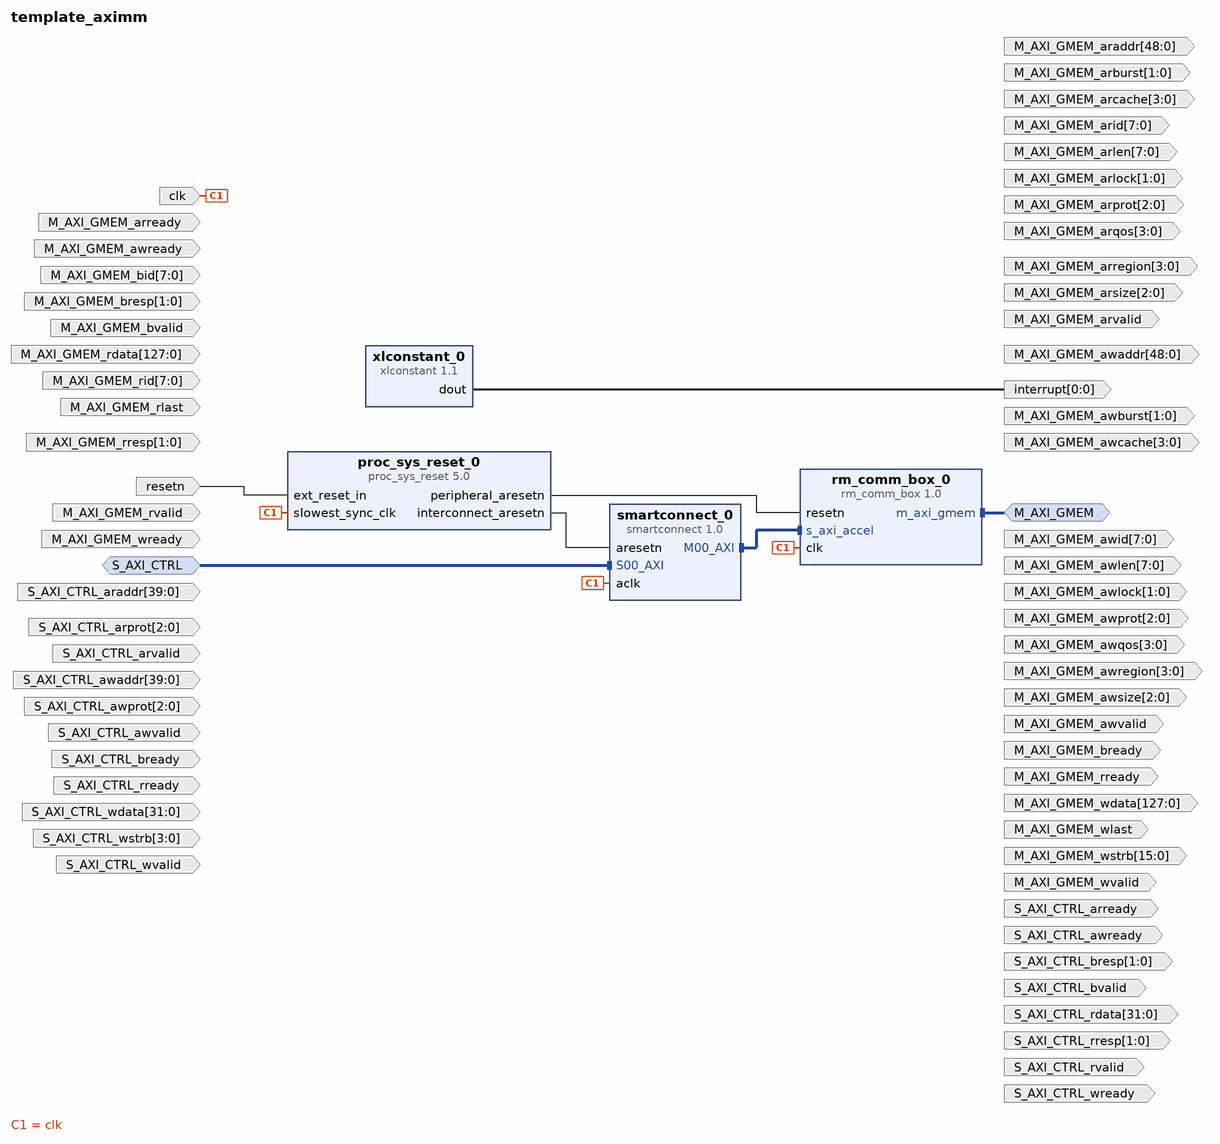
[diagram p0: block diagram of the top level]
# Vivado block design template_aximm, xck26-sfvc784-2LV-c, Vivado 2022.1
create_bd_design template_aximm

create_bd_intf_port -mode Master -vlnv xilinx.com:interface:aximm_rtl:1.0 M_AXI_GMEM
set_property -dict [list \
  CONFIG.ADDR_WIDTH 49 \
  CONFIG.ARUSER_WIDTH 0 \
  CONFIG.AWUSER_WIDTH 0 \
  CONFIG.BUSER_WIDTH 0 \
  CONFIG.CLK_DOMAIN opendfx_shell_zynq_ultra_ps_e_0_0_pl_clk3 \
  CONFIG.DATA_WIDTH 128 \
  CONFIG.FREQ_HZ 249997498 \
  CONFIG.HAS_BRESP 1 \
  CONFIG.HAS_BURST 1 \
  CONFIG.HAS_CACHE 1 \
  CONFIG.HAS_LOCK 1 \
  CONFIG.HAS_PROT 1 \
  CONFIG.HAS_QOS 1 \
  CONFIG.HAS_REGION 1 \
  CONFIG.HAS_RRESP 1 \
  CONFIG.HAS_WSTRB 1 \
  CONFIG.ID_WIDTH 8 \
  CONFIG.INSERT_VIP 0 \
  CONFIG.MAX_BURST_LENGTH 256 \
  CONFIG.NUM_READ_OUTSTANDING 2 \
  CONFIG.NUM_READ_THREADS 1 \
  CONFIG.NUM_WRITE_OUTSTANDING 2 \
  CONFIG.NUM_WRITE_THREADS 1 \
  CONFIG.PHASE 0.0 \
  CONFIG.PROTOCOL AXI4 \
  CONFIG.READ_WRITE_MODE READ_WRITE \
  CONFIG.RUSER_BITS_PER_BYTE 0 \
  CONFIG.RUSER_WIDTH 0 \
  CONFIG.SUPPORTS_NARROW_BURST 1 \
  CONFIG.WUSER_BITS_PER_BYTE 0 \
  CONFIG.WUSER_WIDTH 0 \
] [get_bd_intf_ports M_AXI_GMEM]
create_bd_intf_port -mode Slave -vlnv xilinx.com:interface:aximm_rtl:1.0 S_AXI_CTRL
set_property -dict [list \
  CONFIG.ADDR_WIDTH 40 \
  CONFIG.ARUSER_WIDTH 0 \
  CONFIG.AWUSER_WIDTH 0 \
  CONFIG.BUSER_WIDTH 0 \
  CONFIG.CLK_DOMAIN opendfx_shell_zynq_ultra_ps_e_0_0_pl_clk3 \
  CONFIG.DATA_WIDTH 32 \
  CONFIG.FREQ_HZ 249997498 \
  CONFIG.HAS_BRESP 1 \
  CONFIG.HAS_BURST 0 \
  CONFIG.HAS_CACHE 0 \
  CONFIG.HAS_LOCK 0 \
  CONFIG.HAS_PROT 1 \
  CONFIG.HAS_QOS 0 \
  CONFIG.HAS_REGION 0 \
  CONFIG.HAS_RRESP 1 \
  CONFIG.HAS_WSTRB 1 \
  CONFIG.ID_WIDTH 0 \
  CONFIG.INSERT_VIP 0 \
  CONFIG.MAX_BURST_LENGTH 1 \
  CONFIG.NUM_READ_OUTSTANDING 8 \
  CONFIG.NUM_READ_THREADS 1 \
  CONFIG.NUM_WRITE_OUTSTANDING 8 \
  CONFIG.NUM_WRITE_THREADS 1 \
  CONFIG.PHASE 0.0 \
  CONFIG.PROTOCOL AXI4LITE \
  CONFIG.READ_WRITE_MODE READ_WRITE \
  CONFIG.RUSER_BITS_PER_BYTE 0 \
  CONFIG.RUSER_WIDTH 0 \
  CONFIG.SUPPORTS_NARROW_BURST 0 \
  CONFIG.WUSER_BITS_PER_BYTE 0 \
  CONFIG.WUSER_WIDTH 0 \
  CONFIG.master_id 1 \
] [get_bd_intf_ports S_AXI_CTRL]
create_bd_port -dir O -from 7 -to 0 M_AXI_GMEM_awid
create_bd_port -dir O -from 48 -to 0 M_AXI_GMEM_awaddr
create_bd_port -dir O -from 7 -to 0 M_AXI_GMEM_awlen
create_bd_port -dir O -from 2 -to 0 M_AXI_GMEM_awsize
create_bd_port -dir O -from 1 -to 0 M_AXI_GMEM_awburst
create_bd_port -dir O -from 1 -to 0 M_AXI_GMEM_awlock
create_bd_port -dir O -from 3 -to 0 M_AXI_GMEM_awcache
create_bd_port -dir O -from 2 -to 0 M_AXI_GMEM_awprot
create_bd_port -dir O -from 3 -to 0 M_AXI_GMEM_awregion
create_bd_port -dir O -from 3 -to 0 M_AXI_GMEM_awqos
create_bd_port -dir O M_AXI_GMEM_awvalid
create_bd_port -dir I M_AXI_GMEM_awready
create_bd_port -dir O -from 127 -to 0 M_AXI_GMEM_wdata
create_bd_port -dir O -from 15 -to 0 M_AXI_GMEM_wstrb
create_bd_port -dir O M_AXI_GMEM_wlast
create_bd_port -dir O M_AXI_GMEM_wvalid
create_bd_port -dir I M_AXI_GMEM_wready
create_bd_port -dir I -from 7 -to 0 M_AXI_GMEM_bid
create_bd_port -dir I -from 1 -to 0 M_AXI_GMEM_bresp
create_bd_port -dir I M_AXI_GMEM_bvalid
create_bd_port -dir O M_AXI_GMEM_bready
create_bd_port -dir O -from 7 -to 0 M_AXI_GMEM_arid
create_bd_port -dir O -from 48 -to 0 M_AXI_GMEM_araddr
create_bd_port -dir O -from 7 -to 0 M_AXI_GMEM_arlen
create_bd_port -dir O -from 2 -to 0 M_AXI_GMEM_arsize
create_bd_port -dir O -from 1 -to 0 M_AXI_GMEM_arburst
create_bd_port -dir O -from 1 -to 0 M_AXI_GMEM_arlock
create_bd_port -dir O -from 3 -to 0 M_AXI_GMEM_arcache
create_bd_port -dir O -from 2 -to 0 M_AXI_GMEM_arprot
create_bd_port -dir O -from 3 -to 0 M_AXI_GMEM_arregion
create_bd_port -dir O -from 3 -to 0 M_AXI_GMEM_arqos
create_bd_port -dir O M_AXI_GMEM_arvalid
create_bd_port -dir I M_AXI_GMEM_arready
create_bd_port -dir I -from 7 -to 0 M_AXI_GMEM_rid
create_bd_port -dir I -from 127 -to 0 M_AXI_GMEM_rdata
create_bd_port -dir I -from 1 -to 0 M_AXI_GMEM_rresp
create_bd_port -dir I M_AXI_GMEM_rlast
create_bd_port -dir I M_AXI_GMEM_rvalid
create_bd_port -dir O M_AXI_GMEM_rready
create_bd_port -dir I -from 39 -to 0 S_AXI_CTRL_awaddr
create_bd_port -dir I -from 2 -to 0 S_AXI_CTRL_awprot
create_bd_port -dir I S_AXI_CTRL_awvalid
create_bd_port -dir O S_AXI_CTRL_awready
create_bd_port -dir I -from 31 -to 0 S_AXI_CTRL_wdata
create_bd_port -dir I -from 3 -to 0 S_AXI_CTRL_wstrb
create_bd_port -dir I S_AXI_CTRL_wvalid
create_bd_port -dir O S_AXI_CTRL_wready
create_bd_port -dir O -from 1 -to 0 S_AXI_CTRL_bresp
create_bd_port -dir O S_AXI_CTRL_bvalid
create_bd_port -dir I S_AXI_CTRL_bready
create_bd_port -dir I -from 39 -to 0 S_AXI_CTRL_araddr
create_bd_port -dir I -from 2 -to 0 S_AXI_CTRL_arprot
create_bd_port -dir I S_AXI_CTRL_arvalid
create_bd_port -dir O S_AXI_CTRL_arready
create_bd_port -dir O -from 31 -to 0 S_AXI_CTRL_rdata
create_bd_port -dir O -from 1 -to 0 S_AXI_CTRL_rresp
create_bd_port -dir O S_AXI_CTRL_rvalid
create_bd_port -dir I S_AXI_CTRL_rready
create_bd_port -dir I -type clk clk
set_property -dict [list \
  CONFIG.ASSOCIATED_BUSIF M_AXI_GMEM:S_AXI_CTRL \
  CONFIG.ASSOCIATED_CLKEN s_sc_aclken \
  CONFIG.CLK_DOMAIN opendfx_shell_zynq_ultra_ps_e_0_0_pl_clk3 \
  CONFIG.FREQ_HZ 249997498 \
  CONFIG.FREQ_TOLERANCE_HZ 0 \
  CONFIG.INSERT_VIP 0 \
  CONFIG.PHASE 0.0 \
] [get_bd_ports clk]
create_bd_port -dir O -from 0 -to 0 -type intr interrupt
set_property -dict {CONFIG.PortWidth 1 CONFIG.SENSITIVITY LEVEL_HIGH} [get_bd_ports interrupt]
create_bd_port -dir I -type rst resetn
set_property -dict {CONFIG.INSERT_VIP 0 CONFIG.POLARITY ACTIVE_LOW} [get_bd_ports resetn]

create_bd_cell -type ip -vlnv xilinx.com:ip:proc_sys_reset:5.0 proc_sys_reset_0
create_bd_cell -type ip -vlnv user.org:user:rm_comm_box:1.0 rm_comm_box_0
set_property -dict {CONFIG.USE_BUILT_IN_DMA false} [get_bd_cells rm_comm_box_0]
create_bd_cell -type ip -vlnv xilinx.com:ip:smartconnect:1.0 smartconnect_0
set_property -dict {CONFIG.NUM_MI 1 CONFIG.NUM_SI 1} [get_bd_cells smartconnect_0]
create_bd_cell -type ip -vlnv xilinx.com:ip:xlconstant:1.1 xlconstant_0
set_property -dict {CONFIG.CONST_VAL 0} [get_bd_cells xlconstant_0]

# ---- connections ----

connect_bd_intf_net [get_bd_intf_ports S_AXI_CTRL] [get_bd_intf_pins smartconnect_0/S00_AXI]
connect_bd_intf_net [get_bd_intf_ports M_AXI_GMEM] [get_bd_intf_pins rm_comm_box_0/m_axi_gmem]
connect_bd_intf_net [get_bd_intf_pins smartconnect_0/M00_AXI] [get_bd_intf_pins rm_comm_box_0/s_axi_accel]
connect_bd_net [get_bd_ports clk] [get_bd_pins proc_sys_reset_0/slowest_sync_clk] [get_bd_pins smartconnect_0/aclk] [get_bd_pins rm_comm_box_0/clk]
connect_bd_net [get_bd_pins proc_sys_reset_0/interconnect_aresetn] [get_bd_pins smartconnect_0/aresetn]
connect_bd_net [get_bd_pins proc_sys_reset_0/peripheral_aresetn] [get_bd_pins rm_comm_box_0/resetn]
connect_bd_net [get_bd_ports resetn] [get_bd_pins proc_sys_reset_0/ext_reset_in]
connect_bd_net [get_bd_pins xlconstant_0/dout] [get_bd_ports interrupt]

validate_bd_design
save_bd_design
